# EAGLE design LB_SMD (EAGLE 5.12)
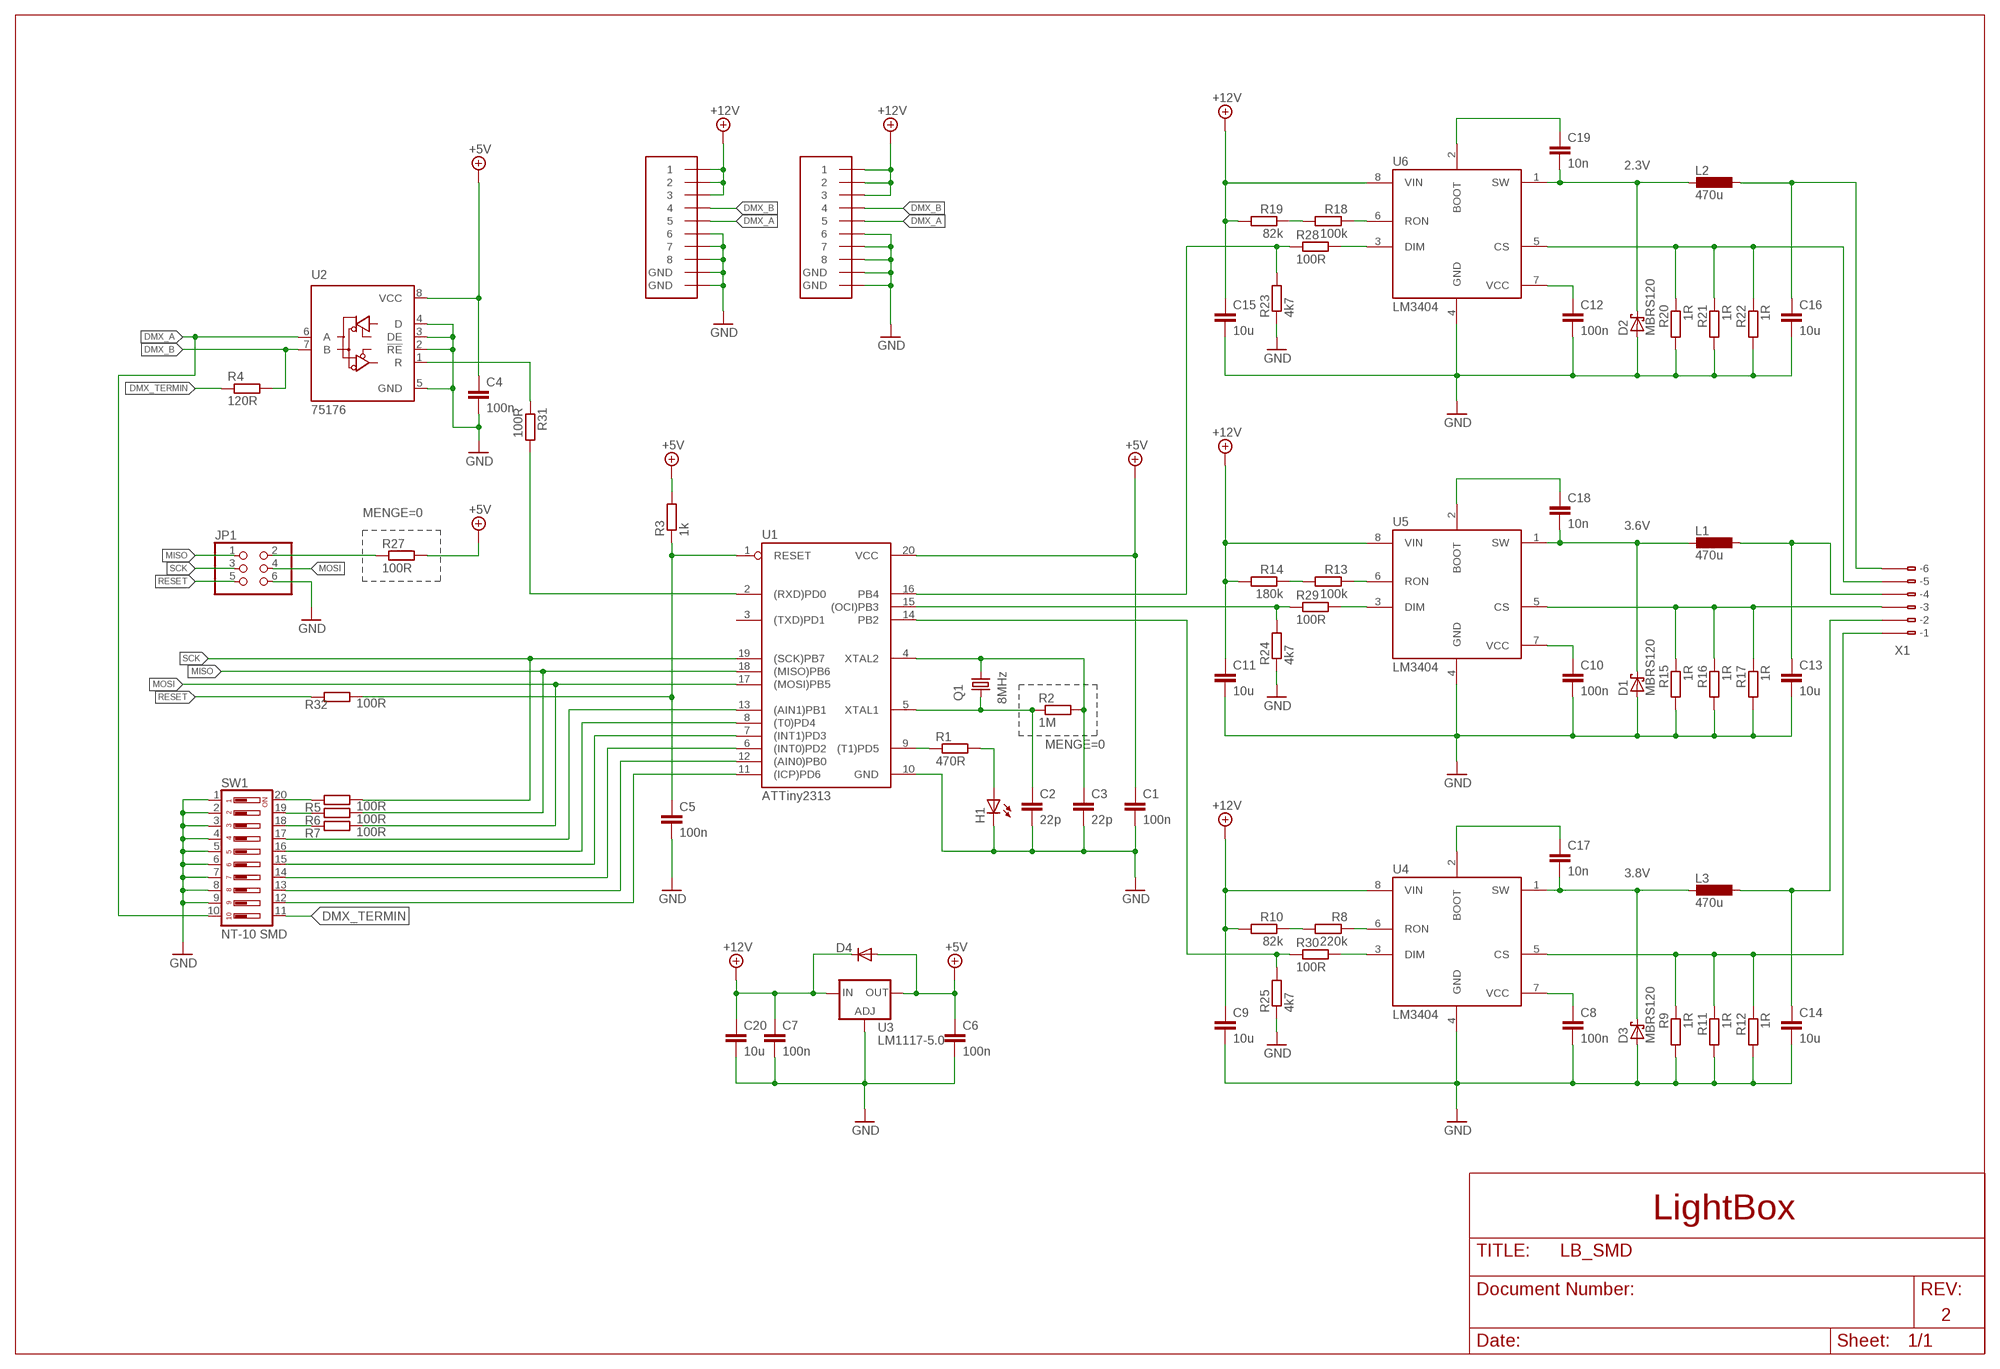
[diagram p0: schematic, sheet 1]

## Parts
C1  100n  C-EUC0805  [C0805]
C2  22p  C-EUC0805  [C0805]
C3  22p  C-EUC0805  [C0805]
C4  100n  C-EUC0805  [C0805]
C5  100n  C-EUC0805  [C0805]
C6  100n  C-EUC0805  [C0805]
C7  100n  C-EUC0805  [C0805]
C8  100n  C-EUC0805  [C0805]
C9  10u  C-1210  [C1210]
C10  100n  C-EUC0805  [C0805]
C11  10u  C-1210  [C1210]
C12  100n  C-EUC0805  [C0805]
C13  10u  C-1210  [C1210]
C14  10u  C-1210  [C1210]
C15  10u  C-1210  [C1210]
C16  10u  C-1210  [C1210]
C17  10n  C-EUC0805  [C0805]
C18  10n  C-EUC0805  [C0805]
C19  10n  C-EUC0805  [C0805]
C20  10u  C-1210  [C1210]
D1  MBRS120  SCHOTTKY-DIODESMD  [SMB]
D2  MBRS120  SCHOTTKY-DIODESMD  [SMB]
D3  MBRS120  SCHOTTKY-DIODESMD  [SMB]
D4  DIODE-SOD323-W  [SOD323-W]
H1  LEDCHIP-LED0805  [CHIP-LED0805]
JP1  PINHD-2X3  [2X03]
L1  470u  L-EUPISR  [PISR]
L2  470u  L-EUPISR  [PISR]
L3  470u  L-EUPISR  [PISR]
Q1  8MHz  CRYSTALHC49S  [HC49/S]
R1  470R  R-EU_R0805  [R0805]
R2  1M  R-EU_R0805  [R0805]
R3  1k  R-EU_R0805  [R0805]
R4  120R  R-EU_R0805  [R0805]
R5  100R  R-EU_R0805  [R0805]
R6  100R  R-EU_R0805  [R0805]
R7  100R  R-EU_R0805  [R0805]
R8  220k  R-EU_R0805  [R0805]
R9  1R  R-EU_R0805  [R0805]
R10  82k  R-EU_R0805  [R0805]
R11  1R  R-EU_R0805  [R0805]
R12  1R  R-EU_R0805  [R0805]
R13  100k  R-EU_R0805  [R0805]
R14  180k  R-EU_R0805  [R0805]
R15  1R  R-EU_R0805  [R0805]
R16  1R  R-EU_R0805  [R0805]
R17  1R  R-EU_R0805  [R0805]
R18  100k  R-EU_R0805  [R0805]
R19  82k  R-EU_R0805  [R0805]
R20  1R  R-EU_R0805  [R0805]
R21  1R  R-EU_R0805  [R0805]
R22  1R  R-EU_R0805  [R0805]
R23  4k7  R-EU_R0805  [R0805]
R24  4k7  R-EU_R0805  [R0805]
R25  4k7  R-EU_R0805  [R0805]
R27  100R  R-EU_R1206  [R1206]
R28  100R  R-EU_R0805  [R0805]
R29  100R  R-EU_R0805  [R0805]
R30  100R  R-EU_R0805  [R0805]
R31  100R  R-EU_R0805  [R0805]
R32  100R  R-EU_R0805  [R0805]
SW1  NT-10 SMD  219-10  [CTS-219-10]
U1  ATTiny2313  AT90S2313S  [SO20L]
U2  75176  75176AD  [D_R-PDSO-G8]
U3  LM1117-5.0  LM317MBSTT3  [SOT223]
U4  LM3404  [D_R-PDSO-G8]
U5  LM3404  [D_R-PDSO-G8]
U6  LM3404  [D_R-PDSO-G8]
U$1  MEBP8-8G  [RJ45-REICHELT]
U$2  MEBP8-8G  [RJ45-REICHELT]
X1  233-506  [233-506]

## Nets
+5V: C1.1 C4.1 C6.1 D4.A R3.2 R27.2 U1.20(VCC) U2.8(VCC) U3.4(OUT)
+12V: C7.1 C9.1 C11.1 C15.1 C20.1 D4.C R10.2 R14.2 R19.2 U3.3(IN) U4.8(VIN) U5.8(VIN) U6.8(VIN) U$1.1 U$1.2 U$1.3 U$2.1 U$2.2 U$2.3
DMX_A: SW1.10 U2.6(A) U$1.5 U$2.5
DMX_B: R4.2 U2.7(B) U$1.4 U$2.4
DMX_TERMIN: R4.1 SW1.11
GND: C1.2 C2.2 C3.2 C4.2 C5.2 C6.2 C7.2 C8.2 C9.2 C10.2 C11.2 C12.2 C13.2 C14.2 C15.2 C16.2 C20.2 D1.A D2.A D3.A H1.C JP1.6 R9.2 R11.2 R12.2 R15.2 R16.2 R17.2 R20.2 R21.2 R22.2 R23.1 R24.1 R25.1 SW1.1 SW1.2 SW1.3 SW1.4 SW1.5 SW1.6 SW1.7 SW1.8 SW1.9 U1.10(GND) U2.2(!RE) U2.3(DE) U2.4(D) U2.5(GND) U3.1(ADJ) U4.4(GND) U5.4(GND) U6.4(GND) U$1.6 U$1.7 U$1.8 U$1.GND@1(GND) U$1.GND@2(GND) U$2.6 U$2.7 U$2.8 U$2.GND@1(GND) U$2.GND@2(GND)
MISO: JP1.1 R6.2 U1.18((MISO)PB6)
MOSI: JP1.4 R7.2 U1.17((MOSI)PB5)
N$1: R1.1 U1.9((T1)PD5)
N$2: C2.1 Q1.2 R2.1 U1.5(XTAL1)
N$3: H1.A R1.2
N$4: C3.1 Q1.1 R2.2 U1.4(XTAL2)
N$5: R31.1 U2.1(R)
N$6: C5.1 R3.1 R32.2 U1.1(RESET)
N$7: JP1.2 R27.1
N$8: R5.1 SW1.20
N$9: R6.1 SW1.19
N$10: R7.1 SW1.18
N$13: SW1.17 U1.13((AIN1)PB1)
N$14: SW1.16 U1.8((T0)PD4)
N$15: SW1.15 U1.7((INT1)PD3)
N$16: SW1.14 U1.6((INT0)PD2)
N$17: SW1.13 U1.12((AIN0)PB0)
N$18: SW1.12 U1.11((ICP)PD6)
N$21: R25.2 R30.1 U1.14(PB2)
N$22: R8.1 U4.6(RON)
N$23: R8.2 R10.1
N$24: C8.1 U4.7(VCC)
N$25: R9.1 R11.1 R12.1 U4.5(CS) X1.B1(B-1)
N$26: C17.2 D3.C L3.2 U4.1(SW)
N$27: R24.2 R29.1 U1.15((OCI)PB3)
N$28: R13.1 U5.6(RON)
N$29: R13.2 R14.1
N$30: C10.1 U5.7(VCC)
N$31: R15.1 R16.1 R17.1 U5.5(CS) X1.B3(B-3)
N$32: C18.2 D1.C L1.2 U5.1(SW)
N$33: R23.2 R28.1 U1.16(PB4)
N$34: R18.1 U6.6(RON)
N$35: R18.2 R19.1
N$36: C12.1 U6.7(VCC)
N$37: R20.1 R21.1 R22.1 U6.5(CS) X1.B5(B-5)
N$38: C19.2 D2.C L2.2 U6.1(SW)
N$39: C13.1 L1.1 X1.B4(B-4)
N$40: C16.1 L2.1 X1.B6(B-6)
N$41: C14.1 L3.1 X1.B2(B-2)
N$42: C17.1 U4.2(BOOT)
N$44: C18.1 U5.2(BOOT)
N$46: C19.1 U6.2(BOOT)
N$50: R28.2 U6.3(DIM)
N$51: R30.2 U4.3(DIM)
N$52: R29.2 U5.3(DIM)
N$53: R31.2 U1.2((RXD)PD0)
RESET: JP1.5 R32.1
SCK: JP1.3 R5.2 U1.19((SCK)PB7)
Unconnected: U1.3((TXD)PD1) X1.A1(-1) X1.A2(-2) X1.A3(-3) X1.A4(-4) X1.A5(-5) X1.A6(-6)

## Notes on the sheet
- 2.3V
- MENGE=0
- 3.6V
- MENGE=0
- 3.8V
- LightBox
- 2

## Library data of the parts
C1-C8 C10 C12 C17-C19 = rcl:C-EU: CAPACITOR, European symbol
C9 C11 C13-C16 C20 = LB:C
D1-D3 = diode:SCHOTTKY-DIODE: Schottky Diode
D4 = diode:DIODE-: DIODE
H1 = led:LED: LED OSRAM: - CHIPLED LG R971, LG N971, LY N971, LG Q971, LY Q971, LO R971, LY R971 LH N974, LH R974 LS Q976, LO Q976, LY Q976 LO Q996 - Hyper CHIPLED LW Q18S LB Q993, LB Q99A, LB R99A - SideLED LS A670, LO A670, LY A670, LG A670, LP A670 LB A673, LV A673, LT A673, LW A673 LH A674 LY A675 LS A676, LA A676, LO A676, LY A676, LW A676 LS A679, LY A679, LG A679 - Hyper Micro SIDELED® LS Y876, LA Y876, LO Y876, LY Y876 LT Y87S - SmartLED LW L88C, LW L88S LB L89C, LB L89S, LG L890 LS L89K, LO L89K, LY L89K LS L896, LA L896, LO L896, LY L896 - TOPLED LS T670, LO T670, LY T670, LG T670, LP T670 LSG T670, LSP T670, LSY T670, LOP T670, LYG T670 LG T671, LOG T671, LSG T671 LB T673, LV T673, LT T673, LW T673 LH T674 LS T676, LA T676, LO T676, LY T676, LB T676, LH T676, LSB T676, LW T676 LB T67C, LV T67C, LT T67C, LS T67K, LO T67K, LY T67K, LW E67C LS E67B, LA E67B, LO E67B, LY E67B, LB E67C, LV E67C, LT E67C LW T67C LS T679, LY T679, LG T679 LS T770, LO T770, LY T770, LG T770, LP T770 LB T773, LV T773, LT T773, LW T773 LH T774 LS E675, LA E675, LY E675, LS T675 LS T776, LA T776, LO T776, LY T776, LB T776 LHGB T686 LT T68C, LB T68C - Hyper Mini TOPLED® LB M676 - Mini TOPLED Santana® LG M470 LS M47K, LO M47K, LY M47K Source: http://www.osram.convergy.de LUXEON: - LUMILED® LXK2-PW12-R00, LXK2-PW12-S00, LXK2-PW14-U00, LXK2-PW14-V00 LXK2-PM12-R00, LXK2-PM12-S00, LXK2-PM14-U00 LXK2-PE12-Q00, LXK2-PE12-R00, LXK2-PE12-S00, LXK2-PE14-T00, LXK2-PE14-U00 LXK2-PB12-K00, LXK2-PB12-L00, LXK2-PB12-M00, LXK2-PB14-N00, LXK2-PB14-P00, LXK2-PB14-Q00 LXK2-PR12-L00, LXK2-PR12-M00, LXK2-PR14-Q00, LXK2-PR14-R00 LXK2-PD12-Q00, LXK2-PD12-R00, LXK2-PD12-S00 LXK2-PH12-R00, LXK2-PH12-S00 LXK2-PL12-P00, LXK2-PL12-Q00, LXK2-PL12-R00 Source: www.luxeon.com KINGBRIGHT: KA-3528ASYC Source: www.kingbright.com
JP1 = pinhead:PINHD-2X3: PIN HEADER
L1-L3 = Inductor-Fastron:L-EU
Q1 = crystal:CRYSTAL: CRYSTAL; OC_FARNELL: 1667008; OC_NEWARK: unknown
R1-R25 R27-R32 = rcl:R-EU_: RESISTOR, European symbol
SW1 = switch-dil:219-10*: Surface Mount DIP Switch Series 219 SMT CTS Electronic Components Sourc: www.ctscorp.com; MF: SLI (CML/IDI); MPN: 219-10PK; OC_FARNELL: unknown; OC_NEWARK: 19M0224
U1 = LB:AT90S2313: MICROCONTROLLER 2 Kbytes FLASH 128 bytes SRAM 128 bytes EEPROM UART; OC_FARNELL: unknown; OC_NEWARK: unknown
U2 = LB:75176A: DIFFERENTIAL BUS TRANSCEIVER Source: http://focus.ti.com/lit/ds/symlink/sn75176a.pdf
U3 = v-reg:LM317?*: 500 mA Adjustable Output Positive Voltage Regulator Source: http://www.onsemi.co.jp .. LM317M-D.PDF
U4-U6 = LB:LM3404
U$1 U$2 = Reichelt:MEBP8-8G
X1 = con-wago:233-506: WAGO Cage Clamp; MF: Wago Corporation; MPN: 0233-0506; OC_FARNELL: 1777100; OC_NEWARK: 79K2052

## Board
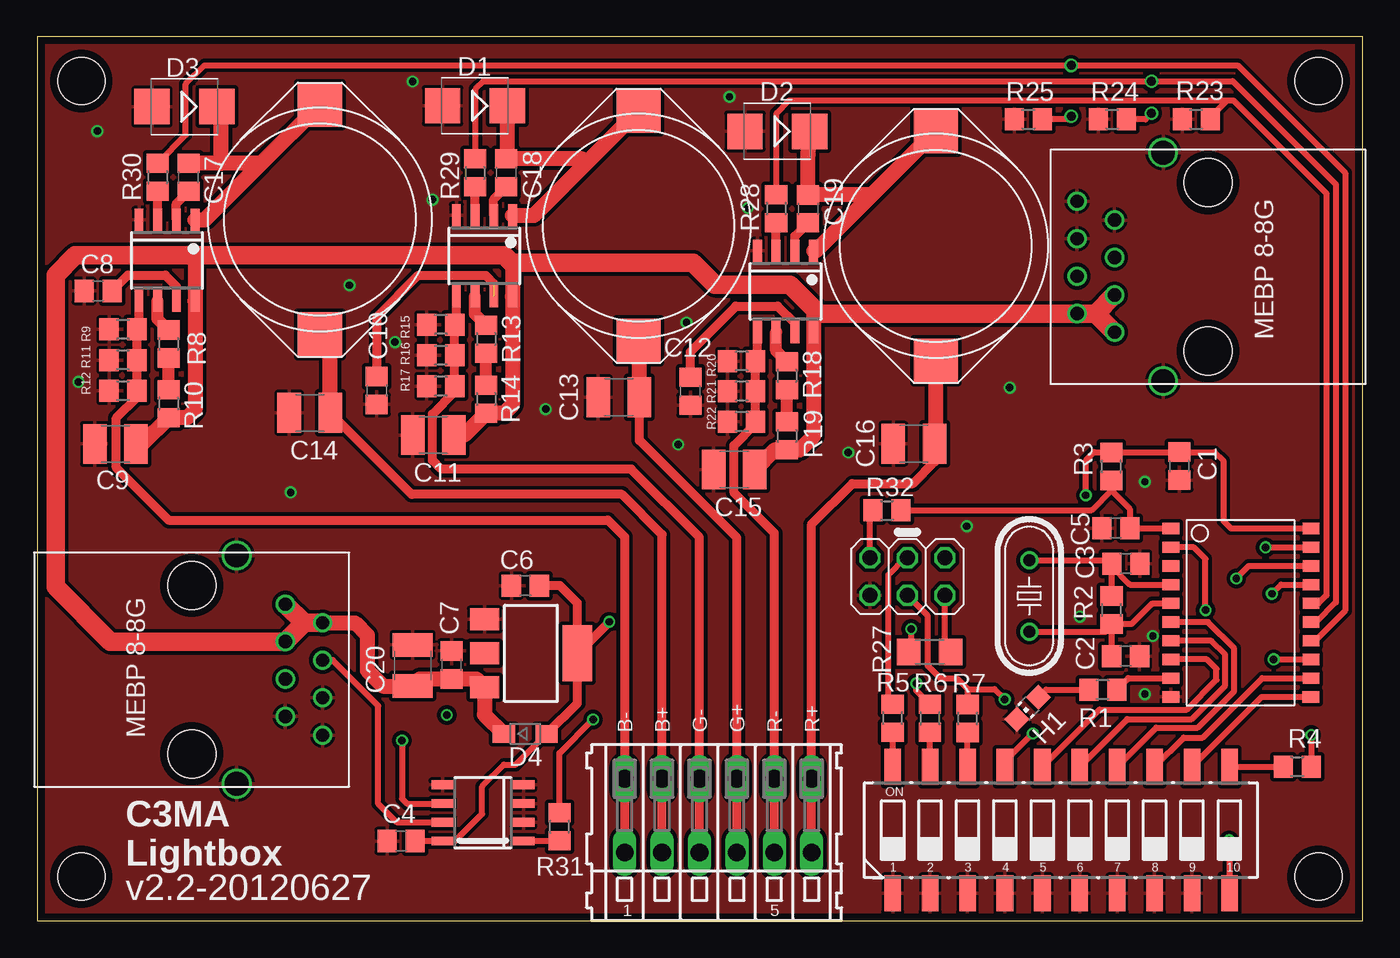
[diagram p1: board, top side]
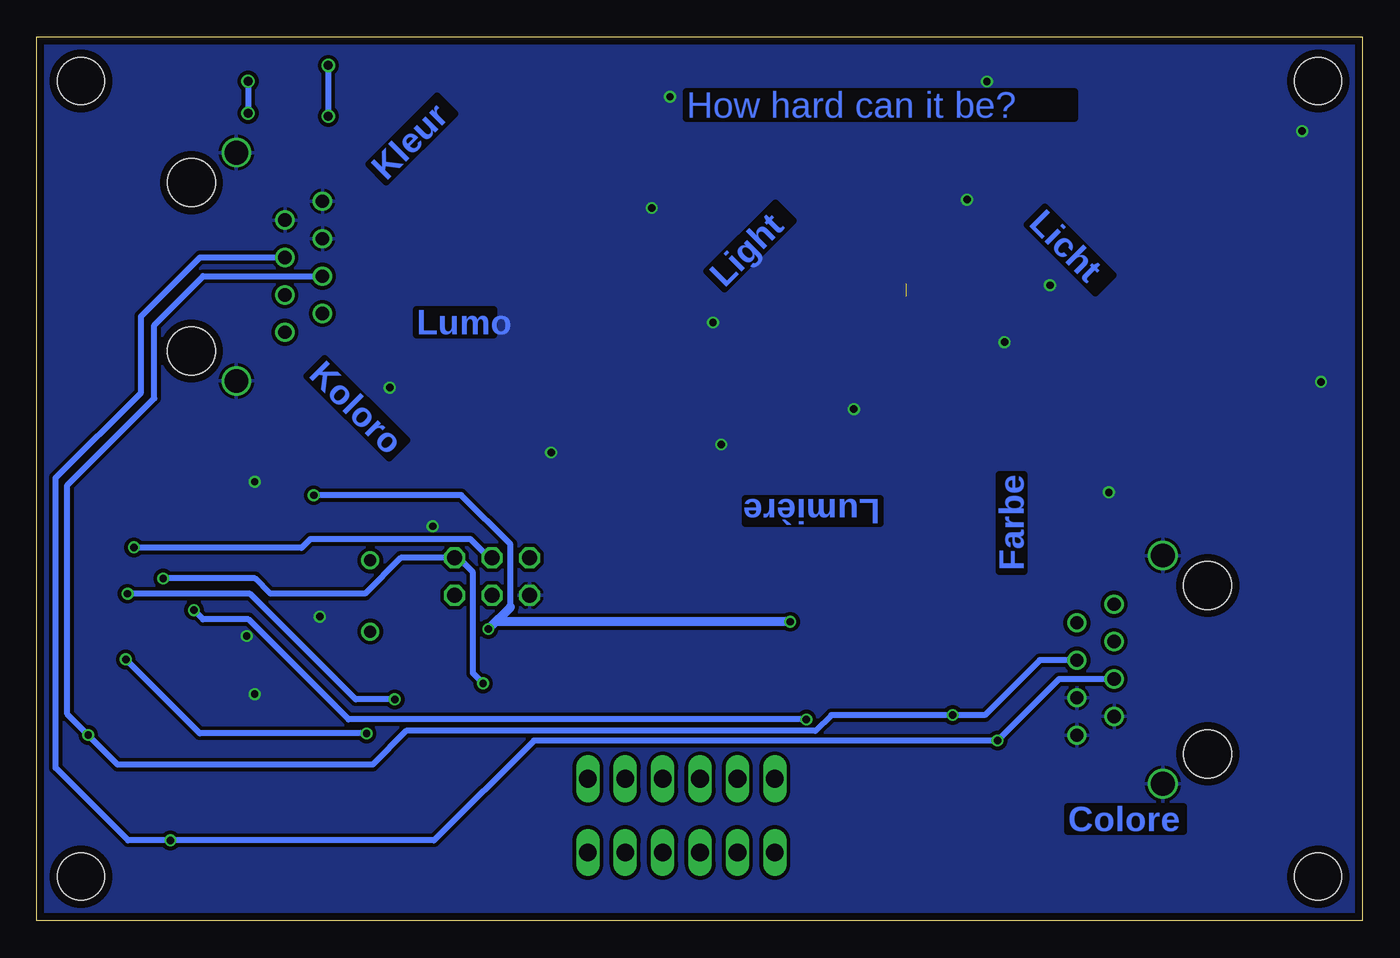
[diagram p2: board, bottom side, seen from below]

Size 90 x 60 mm. Coordinates in mm from the lower left corner, seen from the top.
Outline: 0,0 90,0 90,60 0,60 0,0
Copper layers (1*16): Top 0.035mm / dielectric 1.5mm / Bottom 0.035mm
Design rules "Eagle-DRU - 1109 - LeitOn - 01 and 02 layers": minimum track width 6mil, minimum drill 0.3mm, track to track 6mil, track to pad 6mil, pad to pad 6mil, via to via 6mil, smd to smd 6mil, copper to edge 20mil, drill to drill 10mil, minimum pad ring 8mil, minimum via ring 6mil, stop-mask expansion 3mil, vias tented up to drill 0mil, thermal gap 8mil
Holes 3.2 mm at 3,57 87,3 87,57 3,3

### Footprints (pad centres in the part's own frame; a part is rotated, then mirrored left to right if it is on the bottom)
C0805 = smd 1.3 x 1.5: 1 -0.95,0; 2 0.95,0
C1210 = smd 1.6 x 2.7: 1 -1.4,0; 2 1.4,0
SMB = smd 2.4 x 2.4: A 2.2,0; C -2.2,0
SOD323-W = smd 1.5 x 1.2: A 1.45,0; C -1.45,0
CHIP-LED0805 = smd 1.2 x 1.2: A 0,-1.05; C 0,1.05
2X03 = drill 1.016 octagon: 1 -2.54,-1.27; 2 -2.54,1.27; 3 0,-1.27; 4 0,1.27; 5 2.54,-1.27; 6 2.54,1.27
PISR = smd 3 x 3: 1 -7.8,0; 2 7.8,0
HC49/S = drill 0.813 round: 1 -2.413,0; 2 2.413,0
R0805 = smd 1.3 x 1.5: 1 -0.95,0; 2 0.95,0
R1206 = smd 1.6 x 1.803: 1 -1.422,0; 2 1.422,0
CTS-219-10 = smd 1.13 x 2.44: 1 -11.43,-4.3; 2 -8.89,-4.3; 3 -6.35,-4.3; 4 -3.81,-4.3; 5 -1.27,-4.3; 6 1.27,-4.3; 7 3.81,-4.3; 8 6.35,-4.3; 9 8.89,-4.3; 10 11.43,-4.3; 11 11.43,4.3; 12 8.89,4.3; 13 6.35,4.3; 14 3.81,4.3; 15 1.27,4.3; 16 -1.27,4.3; 17 -3.81,4.3; 18 -6.35,4.3; 19 -8.89,4.3; 20 -11.43,4.3
SO20L = smd 0.762 x 1.143: 1 -5.08,-5.131; 2 -3.81,-5.131; 3 -2.54,-5.131; 4 -1.27,-5.131; 5 0,-5.131; 6 1.27,-5.131; 7 2.54,-5.131; 8 3.81,-5.131; 9 5.08,-5.131; 10 6.35,-5.131; 11 6.35,4.369; 12 5.08,4.394; 13 3.81,4.394; 14 2.54,4.394; 15 1.27,4.394; 16 0,4.394; 17 -1.27,4.394; 18 -2.54,4.394; 19 -3.81,4.394; 20 -5.08,4.394
D_R-PDSO-G8 = smd 0.6 x 1.5: 1 -1.905,-2.75; 2 -0.635,-2.75; 3 0.635,-2.75; 4 1.905,-2.75; 5 1.905,2.75; 6 0.635,2.75; 7 -0.635,2.75; 8 -1.905,2.75
SOT223 = smd 1.5 x 2: 1 -2.3,-3.15; 2 0,-3.15; 3 2.3,-3.15 | smd 3.8 x 2: 4 0,3.15
RJ45-REICHELT = drill 0.9 round: 1 -4.445,6.35; 2 -3.175,8.89; 3 -1.905,6.35; 4 -0.635,8.89; 5 0.635,6.35; 6 1.905,8.89; 7 3.175,6.35; 8 4.445,8.89 | drill 1.6 round: GND@1 -7.745,3.05; GND@2 7.745,3.05 | hole 3.25: -5.715,0; 5.715,0
233-506 = drill 1.2 long: A1 -6.35,2.5; A2 -3.81,2.5; A3 -1.27,2.5; A4 1.27,2.5; A5 3.81,2.5; A6 6.35,2.5; B1 -6.35,-2.5; B2 -3.81,-2.5; B3 -1.27,-2.5; B4 1.27,-2.5; B5 3.81,-2.5; B6 6.35,-2.5

### Placement (x,y rotation side)
C1  77.55,30.87 270 top
C2  73.9,17.97 0 top
C3  73.91,24.25 0 top
C4  24.71,5.42 180 top
C5  73.24,26.66 180 top
C6  33.15,22.75 180 top
C7  28.14,17.37 90 top
C8  4.14,42.75 180 top
C9  5.32,32.37 180 top
C10  23.06,36 270 top
C11  26.9,32.97 180 top
C12  44.35,35.94 270 top
C13  39.49,35.54 180 top
C14  18.51,34.48 180 top
C15  47.33,30.63 180 top
C16  59.53,32.38 180 top
C17  10.28,50.46 90 top
C18  31.85,50.77 90 top
C19  52.34,48.32 90 top
C20  25.5,17.33 90 top
D1  29.73,55.32 180 top
D2  50.26,53.58 180 top
D3  10,55.26 180 top
D4  33.14,12.69 0 top
H1  67.25,14.42 135 top
JP1  59.09,23.36 180 top
L1  40.83,47.18 90 top
L2  61.02,45.81 90 top
L3  19.2,47.6 90 top
Q1  67.36,22.05 270 top
R1  72.35,15.69 180 top
R2  72.95,21.1 90 top
R3  72.94,30.84 90 top
R4  85.56,10.47 0 top
R5  58.09,13.76 90 top
R6  60.63,13.75 90 top
R7  63.18,13.73 90 top
R8  8.93,39.15 270 top
R9  5.83,40.14 180 top
R10  8.93,35.1 270 top
R11  5.83,38.06 180 top
R12  5.83,35.97 180 top
R13  30.49,39.48 270 top
R14  30.49,35.41 270 top
R15  27.41,40.47 180 top
R16  27.41,38.38 180 top
R17  27.41,36.29 180 top
R18  50.91,37 270 top
R19  50.91,32.92 270 top
R20  47.83,37.99 180 top
R21  47.83,35.94 180 top
R22  47.83,33.88 180 top
R23  78.7,54.4 0 top
R24  73,54.4 0 top
R25  67.3,54.4 0 top
R27  60.59,18.26 180 top
R28  50.18,48.34 270 top
R29  29.74,50.77 270 top
R30  8.18,50.47 270 top
R31  35.47,6.39 90 top
R32  57.71,27.86 0 top
SW1  69.52,6.16 0 top
U1  82.1,21.55 270 top
U2  30.27,7.33 90 top
U3  33.53,18.16 270 top
U4  8.82,44.83 180 top
U5  30.37,45.13 180 top
U6  50.81,42.72 180 top
U$1  10.5,17.05 270 top
U$2  79.5,44.39 90 top
X1  46.24,7.14 0 top

### Tracks (layer width: path | path; a pad name or v marks a point on that pad's centre or on a via)
+5V  (via drill 0.5)
  Top 0.406: U3.4 36.71,18.16 | D4.A 32.5,10.6 31.69,10.6 30.22,9.13 30.22,7.26 28.39,5.42 U2.8 C4.1 | U1.20 81.06,26.63 80.54,27.15 80.54,31.22 79.94,31.82 C1.1 76.56,31.79 R3.2 72.92,31.81 71.76,31.81 71.21,31.26 v71.21,28.9 v71.2,28.89 | v59.34,19.81 59.34,18.43 R27.2
  Top 0.61: D4.A 36.68,14.78 U3.4 36.68,21.57 35.5,22.75 C6.1 | 36.71,18.16 v38.85,20.3
  Bottom 0.406: 58.85,20.3 v59.34,19.81 | v71.2,28.89 61.19,28.89 57.85,25.55 57.85,21.3
  Bottom 0.61: v38.85,20.3 58.85,20.3 | v59.34,19.81 57.85,21.3
+12V
  Top 1.016: C15.1 50.07,31.97 R19.2 51.79,31.97 52.72,32.9 U6.8 52.72,41.58 | C11.1 29,32.97 R14.2 31.72,34.46 32.28,35.02 U5.8 32.27,44.66 32.23,44.66 | C9.1 7.15,32.37 R10.2 10.2,34.15 10.72,34.67 U4.8 10.72,44.84 11.06,45.17 | D4.C 30.38,14 U3.3 29.82,16.42 C7.1 25.99,16.42 C20.1 23.49,15.93 22.42,17 22.42,19.39 21.59,20.23 U$1.2 | 71.6,41.22 71.88,41.22 | 46.03,43.18 45.94,43.18
  Top 1.27: 18.12,20.23 U$1.2 | 18.12,20.23 U$1.1 | 18.12,20.23 U$1.3 4.96,18.95 1.25,22.67 1.25,43.83 2.59,45.17 11.06,45.17 31.72,45.17 32.23,44.66 | U$2.2 71.6,41.22 | 71.88,41.22 U$2.3 | 32.27,44.66 44.55,44.66 46.03,43.18 51.12,43.18 52.72,41.58 53.09,41.22 U$2.2 | 71.88,41.22 U$2.1 | U$2.2 71.88,41.22
DMX_A  (via drill 0.5)
  Top 0.406: v24.77,12.24 24.77,8.3 25.11,7.96 U2.6 | v80.93,5.46 80.93,1.88 SW1.10
  Bottom 0.406: U$1.5 20.59,16.41 v24.77,12.24 56.25,12.24 63.03,5.46 v80.93,5.46 83.8,5.46 88.72,10.38 88.72,30.06 82.92,35.86 82.92,41.03 78.92,45.02 U$2.5
DMX_B  (via drill 0.5)
  Top 0.406: U2.7 24.41,6.7 23.16,7.94 23.16,14.6 20.07,17.69 U$1.4 | v86.51,12.61 R4.2
  Bottom 0.406: U$1.4 21.9,17.7 25.63,13.97 v27.82,13.97 36.06,13.97 37.14,12.89 64.92,12.89 67.2,10.61 84.51,10.61 v86.51,12.61 87.93,14.03 87.93,29.57 82.03,35.47 82.03,40.44 78.72,43.76 U$2.4
DMX_TERMIN
  Top 0.406: SW1.11 R4.1
GND  (via drill 0.5)
  other vias: 63.12,26.78 26.84,48.95 21.21,43.14 48.25,48.38 44.09,40.61 75.21,15.39 70.79,20.65 75.21,29.8 2.81,36.58 24.3,39.28 43.53,32.33 66.04,36.19 17.21,29.08 75.75,19.33 34.53,34.73 55.08,31.79 4.09,53.6 25.49,56.97 47.01,55.93
  pour Top (isolate 0.254): 0,0 90,0 90,60 0,60
  pour Bottom (isolate 0.254): 0,60 90,60 90,0 0,0
MISO  (via drill 0.5)
  Top 0.406: U1.18 82.27,24.09 v81.42,23.24 | R6.2 59.7,15.63 v59.7,16.12
  Bottom 0.406: v81.42,23.24 75.18,23.24 74.15,22.21 67.72,22.21 65.3,24.63 JP1.1 61.36,24.63 60.39,23.66 60.39,16.81 v59.7,16.12
MOSI  (via drill 0.5)
  Top 0.406: v83.84,22.2 84.46,22.82 U1.17 | 63.18,15.73 62.49,16.42 61.36,16.42 60.48,17.3 60.48,20.7 JP1.4 | R7.2 63.18,15.73 | v65.7,15.03 65,15.73 63.18,15.73
  Bottom 0.406: v65.7,15.03 68.35,15.03 75.52,22.2 v83.84,22.2
N$1
  Top 0.406: U1.9 74.08,16.47 R1.1
N$2
  Top 0.406: 76.74,21.55 U1.5 75.72,21.55 74.32,20.15 R2.1 | Q1.2 72.57,19.64 R2.1 | R2.1 C2.1
N$3
  Top 0.406: R1.2 68.52,15.69 H1.A
N$4
  Top 0.406: Q1.1 72.75,24.46 C3.1 | R2.2 C3.1 | C3.1 72.96,24.06 74.2,22.82 U1.4
N$5
  Top 0.406: U2.1 35.47,5.42 R31.1
N$6
  Top 0.406: U1.1 74.17,26.63 C5.1 74.19,27.97 72.94,29.22 | R32.2 58.68,27.88 71.6,27.88 72.94,29.22 | 72.94,29.22 R3.1
N$7
  Top 0.406: JP1.2 61.63,18.64 R27.1
N$8
  Top 0.406: SW1.20 R5.1
N$9
  Top 0.406: SW1.19 R6.1
N$10
  Top 0.406: R7.1 SW1.18
N$13  (via drill 0.5)
  Top 0.406: U1.13 v83.96,17.75 | v67.61,12.72 65.71,10.82 SW1.17
  Bottom 0.406: v83.96,17.75 78.93,12.72 v67.61,12.72
N$14
  Top 0.406: SW1.16 72.13,14.34 78.06,14.34 80.07,16.35 80.07,17.1 79.43,17.74 U1.8
N$15
  Top 0.406: SW1.15 74.02,13.69 78.39,13.69 80.66,15.96 80.66,18.08 79.73,19.01 U1.7
N$16
  Top 0.406: SW1.14 75.98,13.11 78.79,13.11 81.28,15.6 81.28,18.49 79.49,20.28 U1.6
N$17
  Top 0.406: SW1.13 77.84,12.43 79.14,12.43 83.18,16.47 U1.12
N$18
  Top 0.406: SW1.12 83.15,15.2 U1.11
N$21  (via drill 0.6)
  Top 0.406: U1.14 86.77,19.01 88.81,21.05 88.81,50.77 81.52,58.06 v70.21,58.06 11.36,58.06 10.1,56.8 10.1,53.34 R30.1 | v70.21,54.61 70,54.4 R25.2
  Bottom 0.406: v70.21,58.06 v70.21,54.61
N$22
  Top 0.813: R8.1 8.19,40.84 U4.6
N$23
  Top 0.813: R10.1 R8.2
N$24
  Top 0.61: U4.7 9.46,43.06 8.7,43.82 6.16,43.82 C8.1
N$25
  Top 0.61: U4.5 6.92,40.27 R9.1 R11.1 R12.1 6.78,35.53 5.38,34.13 5.38,30.75 8.93,27.2 38.76,27.2 39.89,26.07 X1.B1
N$26
  Top 1.016: 19.57,55.3 L3.2 15.21,51.41 | U4.1 11.38,47.58 15.21,51.41 | 15.21,51.41 12.48,51.41 | 12.48,51.41 C17.2 | D3.C 12.48,54.98 12.48,51.41
N$27  (via drill 0.6)
  Top 0.406: U1.15 86.84,20.28 88.18,21.62 88.18,49.98 81.17,56.99 v75.66,56.99 30.3,56.99 29.78,56.47 29.78,51.76 R29.1 | v75.66,54.81 75.25,54.4 R24.2
  Bottom 0.406: v75.66,56.99 v75.66,54.81
N$28
  Top 0.813: U5.6 29.73,41.19 R13.1
N$29
  Top 0.813: R14.1 R13.2
N$30  (1 unrouted)
  Top 0.61: C10.1 23.07,41 25.88,43.81 30.45,43.81 31,43.26
N$31
  Top 0.61: U5.5 28.46,40.58 R15.1 R16.1 R17.1 28.36,35.92 26.84,34.4 26.84,31.26 27.44,30.66 40.34,30.66 44.97,26.03 X1.B3
N$32
  Top 1.016: D1.C 32.42,54.83 32.32,54.72 | D1.C 32.31,54.94 | C18.2 31.89,51.76 | U5.1 33.73,47.88 37.28,51.44 | 37.28,51.44 L1.2 | C18.2 37,51.72 37.28,51.44 | D1.C 31.93,51.8 C18.2
N$33
  Top 0.406: 50.2,49.34 R28.1 50.2,49.31 50.2,54.83 51.06,55.69 80.8,55.69 | U1.16 87,21.55 87.54,22.09 87.54,49.38 81.23,55.69 80.8,55.69 | R23.2 79.65,54.54 80.8,55.69
N$34
  Top 0.813: R18.1 50.17,38.69 U6.6
N$35
  Top 0.813: R19.1 R18.2
N$36
  Top 0.61: U6.7 51.45,40.55 50.28,41.72 47.45,41.72 44.35,38.62 C12.1
N$37
  Top 0.61: U6.5 48.91,38.12 R20.1 R21.1 R22.1 48.78,33.73 47.3,32.25 47.32,32.23 47.32,29.04 50.05,26.31 X1.B5
N$38
  Top 1.016: D2.C 52.34,52.02 C19.2 56.68,49.27 | U6.1 52.88,45.47 56.68,49.27 | L2.2 56.87,49.45 56.68,49.27
N$39
  Top 0.61: X1.B4 47.51,26 40.9,32.61 C13.1
  Top 1.016: C13.1 40.89,39.32 L1.1
N$40
  Top 0.61: 60.93,31.88 60.93,31.16 59.45,29.68 55.35,29.68 52.59,26.92 X1.B6
  Top 0.813: 60.93,31.88 C16.1
  Top 1.016: L2.1 61.02,31.97 60.93,31.88
N$41
  Top 0.61: 20.29,34.48 C14.1 25.44,28.95 39.7,28.95 42.43,26.22 X1.B2
  Top 0.813: 20.29,34.48 20.29,33.57
  Top 1.016: C14.1 19.91,39.09 L3.1
N$42
  Top 0.61: U4.2 9.46,48.69 C17.1
N$44
  Top 0.61: C18.1 31,48.98 U5.2
N$46
  Top 0.61: U6.2 51.45,46.48 C19.1
N$50
  Top 0.61: U6.3 R28.2
N$51
  Top 0.61: 8.19,49.77 R30.2 U4.3
N$52
  Top 0.61: 29.73,49.49 R29.2 U5.3
N$53  (via drill 0.5)
  Top 0.406: v79.33,21.09 79.33,24.56 78.54,25.35 U1.2 | v37.75,13.67 35.47,11.39 R31.2
  Bottom 0.406: v37.75,13.67 68.83,13.67 75.63,20.47 78.71,20.47 v79.33,21.09
RESET
  Top 0.406: R32.1 56.55,27.84 JP1.5
SCK  (via drill 0.5)
  Top 0.406: v83.41,25.35 U1.19 | R5.2 57.79,15.01 57.79,23.49 58.93,24.63 JP1.3
  Bottom 0.406: JP1.3 59.28,24.63 60.56,25.91 71.43,25.91 72.03,25.31 83.37,25.31 v83.41,25.35

### Text on the board
Bottom: How hard can it be? | Kleur | Licht | Light | Lumo | Koloro | Farbe | Lumière | Colore
tPlace: R12 R11 R9 | R17 R16 R15 | R22 R21 R20 | B- | B+ | G- | G+ | R- | R+ | C3MA | Lightbox | v2.2-20120627